# EAGLE schematic untitled (EAGLE 9.6.2)
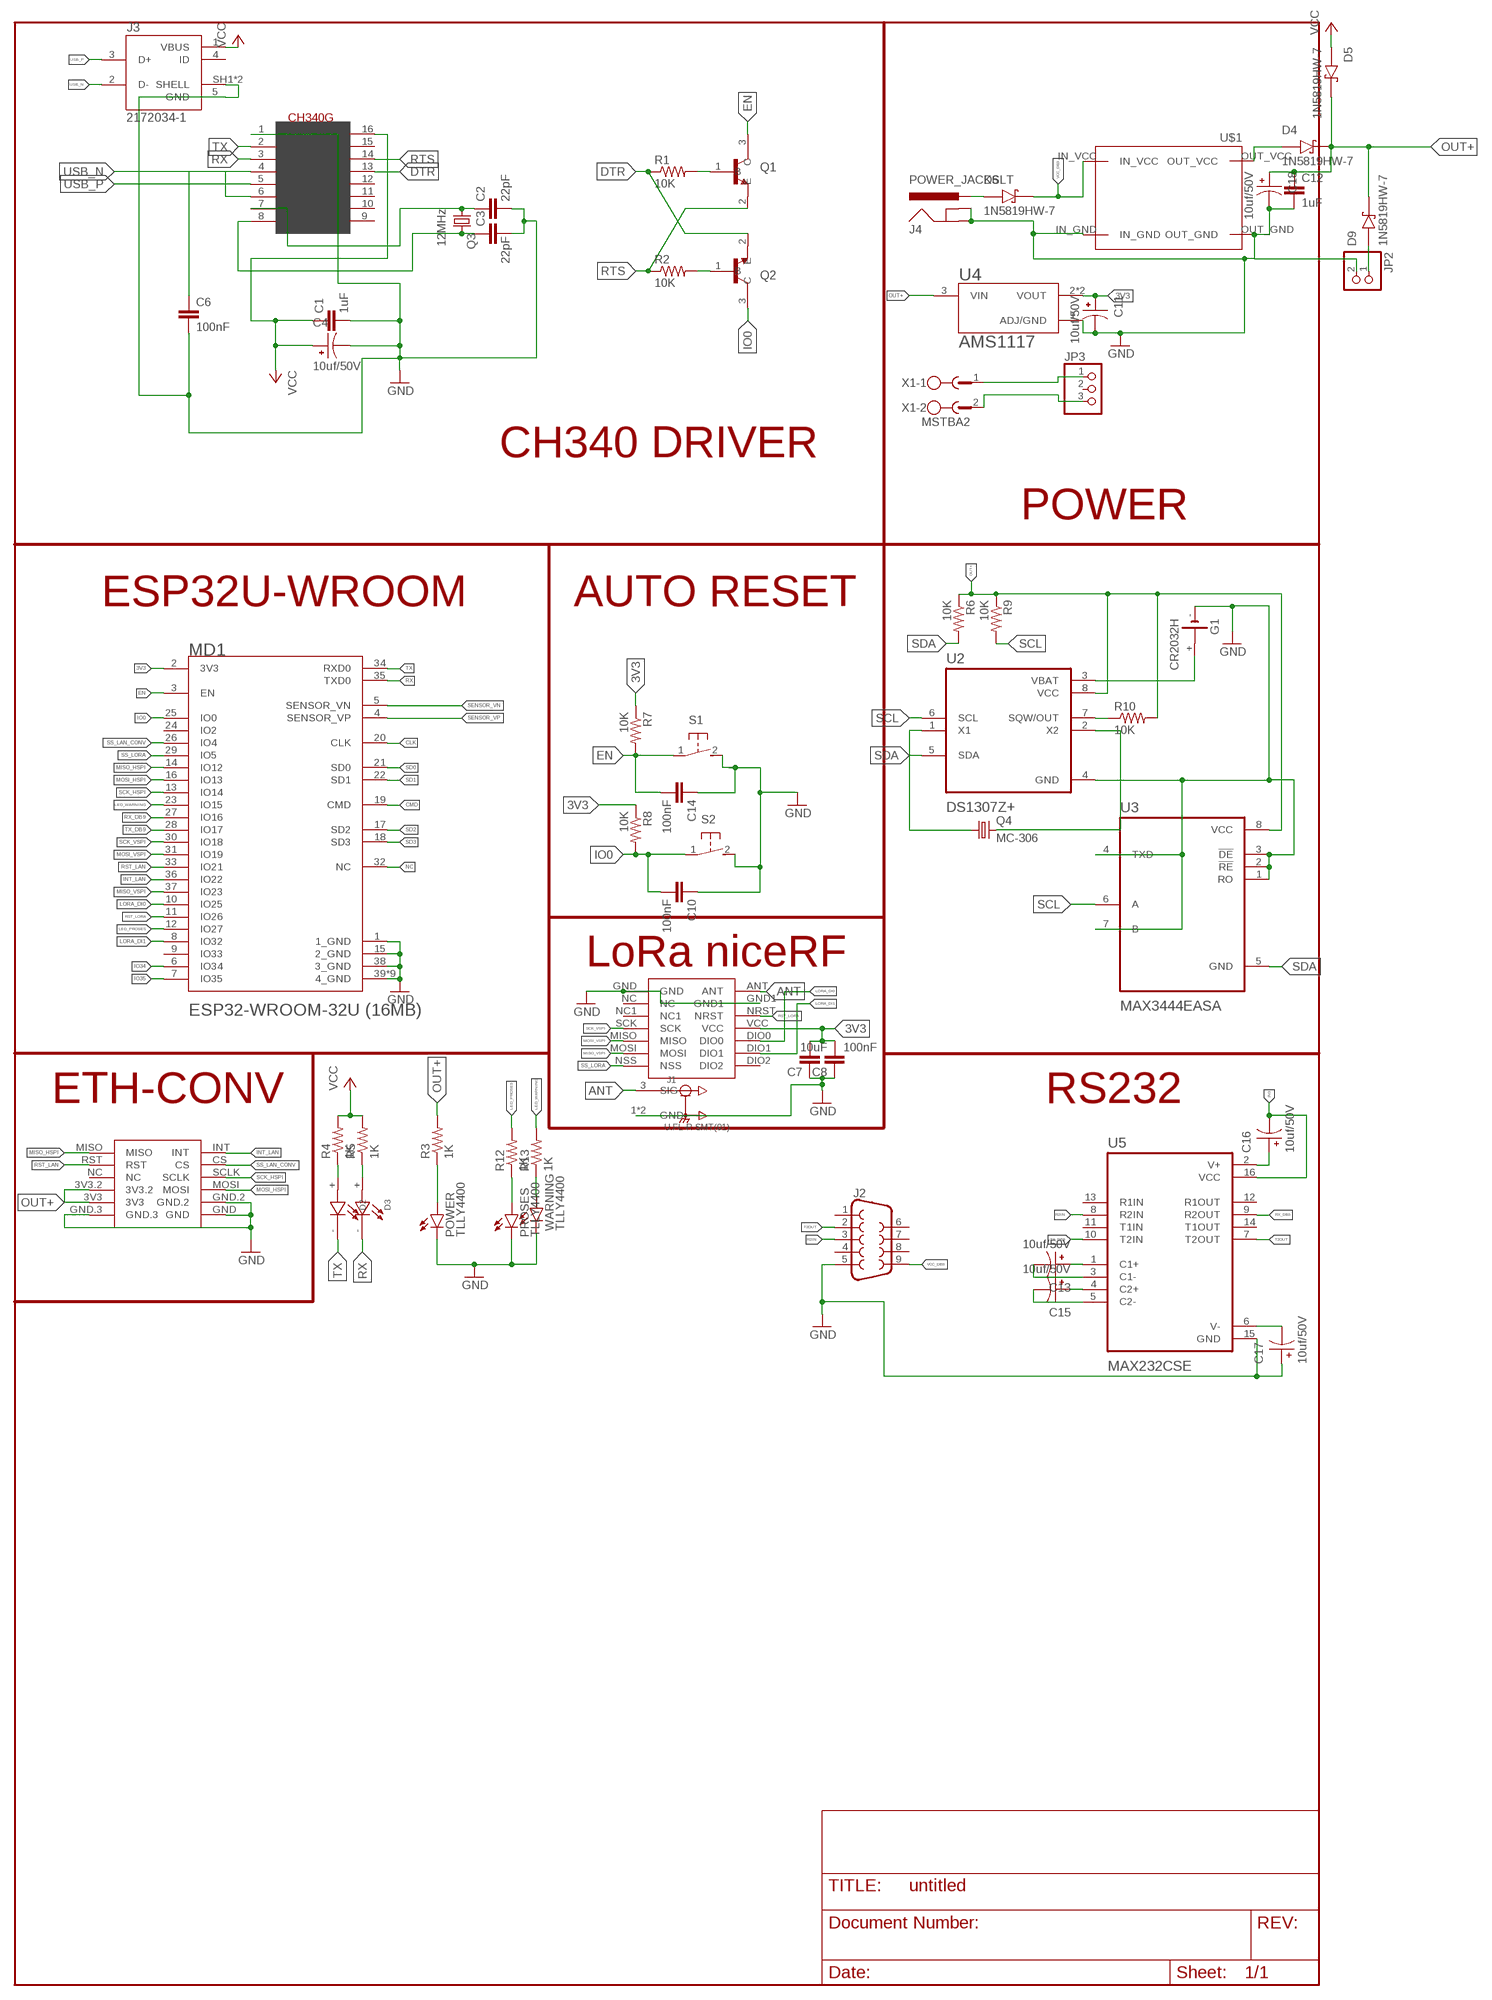
[diagram p0: schematic, sheet 1]

## Parts
C1  1uF  C-EUC0805K  [C0805K]
C2  22pF  C-EUC0805K  [C0805K]
C3  22pF  C-EUC0805K  [C0805K]
C4  10uf/50V  EEEFK1H100V  [CAP_EEEFK1H100V]
C6  100nF  C-EUC0805K  [C0805K]
C7  10uF  C-EUC0805K  [C0805K]
C8  100nF  C-EUC0805K  [C0805K]
C10  100nF  C-EUC0805K  [C0805K]
C11  10uf/50V  EEEFK1H100V  [CAP_EEEFK1H100V]
C12  1uF  C-EUC0805K  [C0805K]
C13  10uf/50V  EEEFK1H100V  [CAP_EEEFK1H100V]
C14  100nF  C-EUC0805K  [C0805K]
C15  10uf/50V  EEEFK1H100V  [CAP_EEEFK1H100V]
C16  10uf/50V  EEEFK1H100V  [CAP_EEEFK1H100V]
C17  10uf/50V  EEEFK1H100V  [CAP_EEEFK1H100V]
C18  10uf/50V  EEEFK1H100V  [CAP_EEEFK1H100V]
D2  Tx  LHN974_RED_LED_1206  [LEDC3216X120N]
D3  Rx  LHN974_RED_LED_1206  [LEDC3216X120N]
D4  1N5819HW-7  [SOD3715X145N]
D5  1N5819HW-7  [SOD3715X145N]
D6  1N5819HW-7  [SOD3715X145N]
D9  1N5819HW-7  [SOD3715X145N]
G1  CR2032H  [CR2032H]
J1  U.FL-R-SMT(01)  [HRS_U.FL-R-SMT(01)]
J2  DB9FEMALE  [DB9]
J3  2172034-1  [TE_2172034-1]
J4  POWER_JACKSLT  [POWER_JACK_SLOT]
JP2  PINHD-1X2  [1X02]
JP3  PINHD-1X3  [1X03]
LORA-NICERF-V1  LORA-NICERF-V2  [LORA-NICERF-V2]
MD1  ESPRESSIF_SYSTEMS_ESP32-WROOM-32U_16MBESPRESSIF_SYSTEMS_ESP32-WROOM-32U_16MB_0_0  [ESPRESSIF_SYSTEMS_ESP32-WROOM-32U_16MB_0]
POWER  TLLY4400  [LED3MM]
PROSES  TLLY4400  [LED3MM]
Q1  MMBT3904  [SOT95P240X120-3N]
Q2  MMBT3904  [SOT95P240X120-3N]
Q3  12MHz  CRYSTALSM49  [SM49]
Q4  MC-306  [MC-306]
R1  10K  R-US_M0805  [M0805]
R2  10K  R-US_M0805  [M0805]
R3  1K  R-US_M0805  [M0805]
R4  1K  R-US_M0805  [M0805]
R5  1K  R-US_M0805  [M0805]
R6  10K  R-US_M0805  [M0805]
R7  10K  R-US_M0805  [M0805]
R8  10K  R-US_M0805  [M0805]
R9  10K  R-US_M0805  [M0805]
R10  10K  R-US_M0805  [M0805]
R12  1K  R-US_M0805  [M0805]
R13  1K  R-US_M0805  [M0805]
S1  31-XX  [B3F-31XX]
S2  31-XX  [B3F-31XX]
U2  DS1307Z+  [SOIC127P600X175-8N]
U3  MAX3444EASA  [SOIC127P600X175-8N]
U4  AMS1117  [SOT229P700X180-4N]
U5  MAX232CSE  [SOIC127P600X175-16N]
U$1  STEPDOWN_SY8205  [STEPDOWN_SY8205]
U$2  CH340G  [SOIC16]
U$3  MINI_W5500  [MINI_W5500]
WARNING  TLLY4400  [LED3MM]
X1  MSTBA2  [MSTBA2]

## Nets
3V3: C7.2 C8.2 C11.1 C16.2 LORA-NICERF-V1.VCC MD1.2(3V3) R7.1 R8.1 U4.2(VOUT) U4.4(VOUT) U5.16(VCC)
ANT: J1.3(SIG) LORA-NICERF-V1.ANT
CLK: MD1.20(CLK)
CMD: MD1.19(CMD)
DTR: Q2.2(E) R1.1 U$2.13(DTR)
EN: C14.2 MD1.3(EN) Q1.3(C) R7.2 S1.1(P)
GND: C1.2 C2.2 C3.2 C4.2 C6.2 C7.1 C8.1 C10.1 C11.2 C12.2 C14.1 C17.1 C18.2 G1.- J1.1(GND) J1.2(GND) J2.5 J3.5(GND) J3.SH1(SHELL) J3.SH2(SHELL) J4.GND@1(GNDBREAK) J4.GND@2(GND) JP2.2 LORA-NICERF-V1.GND LORA-NICERF-V1.GND1 MD1.1(1_GND) MD1.15(2_GND) MD1.38(3_GND) MD1.39(4_GND) MD1.39-2(4_GND) MD1.39-3(4_GND) MD1.39-4(4_GND) MD1.39-5(4_GND) MD1.39-6(4_GND) MD1.39-7(4_GND) MD1.39-8(4_GND) MD1.39-9(4_GND) POWER.K(C) PROSES.K(C) S1.2(S) S2.2(S) U2.4(GND) U3.1(RO) U3.2(!RE) U3.3(!DE) U3.4(TXD) U3.7(B) U4.1(ADJ/GND) U5.15(GND) U$1.IN_GND U$1.OUT_GND U$2.1(GND) U$3.GND U$3.GND.2 U$3.GND.3 WARNING.K(C)
INT_LAN: MD1.36(IO22) U$3.INT
IO0: C10.2 MD1.25(IO0) Q2.3(C) R8.2 S2.1(P)
IO34: MD1.6(IO34)
IO35: MD1.7(IO35)
LED_PROSES: MD1.12(IO27) R12.2
LED_WARNING: MD1.23(IO15) R13.2
LORA_DI0: LORA-NICERF-V1.DIO0 MD1.10(IO25)
LORA_DI1: LORA-NICERF-V1.DIO1 MD1.8(IO32)
MISO_HSPI: MD1.14(IO12) U$3.MISO
MISO_VSPI: LORA-NICERF-V1.MOSI MD1.37(IO23)
MOSI_HSPI: MD1.16(IO13) U$3.MOSI
MOSI_VSPI: LORA-NICERF-V1.MISO MD1.31(IO19)
N$1: C2.1 Q3.1 U$2.7(XI)
N$2: C3.1 Q3.2 U$2.8(XO)
N$3: POWER.A R3.1
N$4: Q1.1(B) R1.2
N$5: Q2.1(B) R2.2
N$6: Q4.1 U2.1(X1)
N$7: Q4.4 U2.2(X2)
N$8: D2.+ R4.1
N$9: D3.+ R5.1
N$10: C13.1 U5.1(C1+)
N$11: D4.A U$1.OUT_VCC
N$12: C6.1 U$2.4(V3)
N$13: JP3.1 X1.1
N$14: C13.2 U5.3(C1-)
N$15: G1.+ U2.3(VBAT)
N$16: JP3.3 X1.2
N$17: D9.A JP2.1
N$18: R10.1 U2.7(SQW/OUT)
N$19: C15.1 U5.4(C2+)
N$23: D6.A J4.PWR
N$24: C15.2 U5.5(C2-)
N$25: PROSES.A R12.1
N$26: C16.1 U5.2(V+)
N$27: C17.2 U5.6(V-)
N$28: R13.1 WARNING.A
NC: MD1.32(NC)
OUT+: C12.1 C18.1 D4.C(K) D5.C(K) D9.C(K) R3.2 R6.1 R9.1 R10.2 U2.8(VCC) U3.8(VCC) U4.3(VIN) U$3.3V3 U$3.3V3.2
R2IN: J2.3 U5.8(R2IN)
RST_LAN: MD1.33(IO21) U$3.RST
RST_LORA: LORA-NICERF-V1.NRST MD1.11(IO26)
RTS: Q1.2(E) R2.1 U$2.14(RTS)
RX: D3.- MD1.35(TXD0) U$2.3(RX)
RX_DB9: MD1.27(IO16) U5.9(R2OUT)
SCK_HSPI: MD1.13(IO14) U$3.SCLK
SCK_VSPI: LORA-NICERF-V1.SCK MD1.30(IO18)
SCL: R9.2 U2.6(SCL) U3.6(A)
SD0: MD1.21(SD0)
SD1: MD1.22(SD1)
SD2: MD1.17(SD2)
SD3: MD1.18(SD3)
SDA: R6.2 U2.5(SDA) U3.5(GND)
SENSOR_VN: MD1.5(SENSOR_VN)
SENSOR_VP: MD1.4(SENSOR_VP)
SS_LAN_CONV: MD1.26(IO4) U$3.CS
SS_LORA: LORA-NICERF-V1.NSS MD1.29(IO5)
T2OUT: J2.2 U5.7(T2OUT)
TX: D2.- MD1.34(RXD0) U$2.2(TX)
TX_DB9: MD1.28(IO17) U5.10(T2IN)
USB_N: J3.2(D-) U$2.6(D-)
USB_P: J3.3(D+) U$2.5(D+)
VCC: C1.1 C4.1 D5.A J3.1(VBUS) R4.2 R5.2 U$2.16(VCC)
VCC_DB9: D6.C(K) J2.9 U$1.IN_VCC
Unconnected: J2.1 J2.4 J2.6 J2.7 J2.8 J3.4(ID) JP3.2 LORA-NICERF-V1.DIO2 LORA-NICERF-V1.NC LORA-NICERF-V1.NC1 MD1.9(IO33) MD1.24(IO2) U5.11(T1IN) U5.12(R1OUT) U5.13(R1IN) U5.14(T1OUT) U$2.9(CTS) U$2.10(DSR) U$2.11(RI) U$2.12(DCD) U$2.15(RS232) U$3.NC

## Notes on the sheet
- CH340 DRIVER
- POWER
- ESP32U-WROOM | AUTO RESET
- LoRa niceRF
- ETH-CONV | RS232

## Library data of the parts
C1-C3 C6-C8 C10 C12 C14 = rcl:C-EU: CAPACITOR, European symbol; SPICEPREFIX: C
C4 C11 C13 C15-C18 = EEEFK1H100V:EEEFK1H100V: Check availability <https://pricing.snapeda.com/parts/EEEFK1H100V/Panasonic/view-part?ref=eda>; AVAILABILITY: In Stock; DESCRIPTION: CAP ALUM 10UF 20% 50V SMD; MF: Panasonic; MP: EEEFK1H100V; PACKAGE: RADIAL-2 Panasonic; PRICE: None; PURCHASE-URL: https://pricing.snapeda.com/search/part/EEEFK1H100V/?ref=eda
D2 D3 = LHN974_RED_LED_1206:LHN974_RED_LED_1206: LED Chip 1206 Check availability <https://pricing.snapeda.com/parts/LHN974%20RED%20LED%201206/Osram/view-part?ref=eda>; AVAILABILITY: Not in stock; DESCRIPTION: 2.6 V Red LED SMD; MF: Osram; MP: LHN974 RED LED 1206; PACKAGE: None; PRICE: None
D4-D6 D9 = 1N5819HW-7:1N5819HW-7: 1N5819HW Series 40 V 1 A Surface Mount Schottky Barrier Rectifier - SOD-123 Check availability <https://pricing.snapeda.com/parts/1N5819HW-7/Diodes%20Inc./view-part?ref=eda>; AVAILABILITY: In Stock; DESCRIPTION: Diode Schottky 40 V 1A Surface Mount SOD-123; MF: Diodes Inc.; MP: 1N5819HW-7; PACKAGE: SOD-123 Fairchild Semiconductor; PRICE: None; PURCHASE-URL: https://pricing.snapeda.com/search/part/1N5819HW-7/?ref=eda
G1 = battery_cr2032:CR2032H: LI BATTERY Varta
J1 = U.FL-R-SMT_01_:U.FL-R-SMT(01): U.FL Series 6 Ghz 50 Ohm Ultra-small SMT Coaxial Cable Receptacle Check availability <https://pricing.snapeda.com/parts/U.FL-R-SMT%2801%29/Hirose/view-part?ref=eda>; AVAILABILITY: In Stock; DESCRIPTION: U.FL (UMCC) Connector Receptacle, Male Pin 50Ohm Surface Mount Solder. RF Connectors / Coaxial Connectors; MF: Hirose; MP: U.FL-R-SMT(01); PACKAGE: None; PRICE: None; PURCHASE-URL: https://pricing.snapeda.com/search/part/U.FL-R-SMT(01)/?ref=eda
J2 = SparkFun-Connectors:DB9: DB9 Connector Standard DB9 (D-Sub 9) serial connector. Can be used for CAN bus as well as RS485 and RS232. Footprint production proven. Here is the female version connector we sell at SparkFun: 9 Pin Female Serial Connector - PCB Mount <https://www.sparkfun.com/products/429> (PRT-00429) This connector has been used on the following SparkFun products: SparkFun RS232 Shifter - SMD <https://www.sparkfun.com/products/449> (PRT-00449) SparkFun RS232 Shifter SMD (No DB9) <https://www.sparkfun.com/products/8780> (PRT-08780); PROD_ID: CONN-08194
J3 = 2172034-1:2172034-1: CONN RCPT USB MINI B 2.0 PCB R/A Check availability <https://pricing.snapeda.com/parts/2172034-1/TE%20Connectivity/view-part?ref=eda>; AVAILABILITY: In Stock; COMMENT: 2172034-1; DESCRIPTION: Conn Mini USB Type B RCP 5 POS 0.8mm Solder RA Thru-Hole 5 Terminal 1 Port Box/Tray; EU_ROHS_COMPLIANCE: Compliant; MF: TE Connectivity; MP: 2172034-1; PACKAGE: None; PRICE: None; PURCHASE-URL: https://pricing.snapeda.com/search/part/2172034-1/?ref=eda
J4 = SparkFun-Connectors:POWER_JACK: Power Jack Connector This is the standard 5.5mm barrel jack for power. The PTH is the most common, proven, reliable, footprint. The Slot footprint only works if the mill layer is transmitted to the PCB fab house so be warned. Here are the connectors we sell at SparkFun: DC Barrel Power Jack/Connector <https://www.sparkfun.com/products/119> (PRT-00119) DC Barrel Power Jack/Connector (SMD) <https://www.sparkfun.com/products/12748> (PRT-12748) DC Barrel Jack Adapter - Breadboard Compatible <https://www.sparkfun.com/products/10811> (PRT-10811) It is used on this SparkFun product (and many, many others): SparkFun RedBoard - Programmed with Arduino <https://www.sparkfun.com/products/12757> (DEV-12757) Also, if you need a mating power supply or connector, please check these out: Wall Adapter Power Supply - 9VDC 650mA <https://www.sparkfun.com/products/298> (TOL-00298) DC Barrel Jack Adapter - Male <https://www.sparkfun.com/products/10287> (PRT-10287); PROD_ID: PRT-00119
JP2 = pinhead:PINHD-1X2: PIN HEADER
JP3 = pinhead:PINHD-1X3: PIN HEADER
LORA-NICERF-V1 = LORA-NICERF-V2:LORA-NICERF-V2
MD1 = Espressif Systems - ESP32-WROOM-32U (16MB):ESPRESSIF_SYSTEMS_ESP32-WROOM-32U_16MB: Bluetooth, WiFi 802.11b/g/n, Bluetooth v4.2 +EDR, Class 1, 2 and 3 Transceiver Module 2.4GHz ~ 2.5GHz Antenna Not Included, U.FL Surface Mount; AUTOMOTIVE: No; BANDWIDTH: 72MHz; CENTROID_NOT_SPECIFIED: No; DATASHEET: https://www.espressif.com/sites/default/files/documentation/esp32-wroom-32d_esp32-wroom-32u_datasheet_en.pdf; DATA_RATE: 150Mbits/s; DEVICE_CLASS_L1: Integrated Circuits (ICs); DEVICE_CLASS_L2: RF Semiconductors and Devices; DEVICE_CLASS_L3: Transceivers; DIGIKEY_DESCRIPTION: RX TXRX MODULE WIFI U.FL SMD; DIGIKEY_PART_NUMBER: 1904-1028-1-ND; FOOTPRINT_VARIANT_NAME_0: Recommended_Land_Pattern; HEIGHT: 3.35mm; INTERFACE: I2C,SPI,UART,Ethernet,I2S,Other; LEAD_FREE: Yes; MAX_FREQUENCY: 2484MHz; MAX_SUPPLY_VOLTAGE: 3.6V; MF: Espressif Systems; MFG_PACKAGE_IDENT: 0; MFG_PACKAGE_IDENT_DATE: 0; MFG_PACKAGE_IDENT_REV: 0; MIN_SUPPLY_VOLTAGE: 3V; MOUSER_PART_NUMBER: 356-ES32WROOM32U16MB; MPN: ESP32-WROOM-32U (16MB); NOMINAL_SUPPLY_CURRENT: 0.5A; NUMBER_OF_ADC_CHANNELS: 16; NUMBER_OF_GPIO: 26; PACKAGE: BT_MODULE; PREFIX: MD; ROHS: Yes; SENSITIVITY: -98dBm; TEMPERATURE_RANGE_HIGH: +85°C; TEMPERATURE_RANGE_LOW: -40°C; VERIFICATION_VERSION: 0.0.0.3
POWER PROSES WARNING = led:TLLY4400: Low Current (2mA) LED 3 mm Tinted Diffused Package color YELLOW Source: Data sheet <http://www.farnell.com/datasheets/391098.pdf>; MF: VISHAY SEMICONDUCTOR; OC_FARNELL: 1612439
Q1 Q2 = MMBT3904:MMBT3904: MMBT3904 Series 40 V CE Breakdown 0.2 A NPN General Purpose Amplifier - SOT-23 Check availability <https://pricing.snapeda.com/parts/MMBT3904/STMicroelectronics/view-part?ref=eda>; AVAILABILITY: Not in stock; DESCRIPTION: SMD Transistor MMBT3904 SOT-23 SMD DIOTEC; MF: STMicroelectronics; MP: MMBT3904; PACKAGE: SOT-23 ON; PRICE: None
Q3 = adafruit:CRYSTAL: CRYSTAL; OC_FARNELL: unknown; OC_NEWARK: unknown
Q4 = crystal:MC-306: kHz RANGE CRYSTAL UNIT SMD Source: MC-306_405_406_E07X.PDF Homepage <http://www.epsontoyocom.co.jp>; MPN: MC-306 60.0KHZ 100PPM ,12.5PF; OC_FARNELL: 1278040; OC_NEWARK: 31M5576
R1-R10 R12 R13 = adafruit:R-US_: RESISTOR, American symbol
S1 S2 = switch-omron:31-XX: OMRON SWITCH; MPN: B3F-3100; OC_FARNELL: 959704; OC_NEWARK: 36M3582
U2 = DS1307Z_:DS1307Z+: Check availability <https://pricing.snapeda.com/parts/DS1307Z/Maxim%20Integrated/view-part?ref=eda>; AVAILABILITY: In Stock; DESCRIPTION: Real Time Clock (RTC) IC Clock/Calendar 56B I²C, 2-Wire Serial 8-SOIC (0.154, 3.90mm Width); MF: Maxim Integrated; MP: DS1307Z; PACKAGE: SOIC-8 Maxim; PRICE: None; PURCHASE-URL: https://pricing.snapeda.com/search/part/DS1307Z/?ref=eda
U3 = MAX3444EASA:MAX3444EASA: Check availability <https://pricing.snapeda.com/parts/MAX3444EASA%2B/Maxim%20Integrated/view-part?ref=eda>; AVAILABILITY: In Stock; DESCRIPTION: Interface IC - transceivers Maxim Integrated MAX3444EASA+ J1708 1/1 SOIC 8 N; MF: Maxim Integrated; MP: MAX3444EASA+; PACKAGE: SOIC-8 Maxim; PRICE: None; PURCHASE-URL: https://pricing.snapeda.com/search/part/MAX3444EASA+/?ref=eda
U4 = AMS1117:AMS1117: Sot223/Pkg 1-Amp 5-Volt Low Drop Out Voltage Regulatator Check availability <https://pricing.snapeda.com/parts/AMS1117/Advanced%20Monolithic%20Systems/view-part?ref=eda>; AVAILABILITY: Not in stock; DESCRIPTION: 1A LOW DROPOUT VOLTAGE REGULATOR SOT-223; MF: Advanced Monolithic Systems; MP: AMS1117; PACKAGE: SOT-223 Seeed Technology; PRICE: None
U5 = MAX232CSE:MAX232CSE: Check availability <https://pricing.snapeda.com/parts/MAX232CSE/Maxim%20Integrated/view-part?ref=eda>; AVAILABILITY: In Stock; DESCRIPTION: 2/2 Transceiver Full RS232 16-SOIC; MF: Maxim Integrated; MP: MAX232CSE; PACKAGE: SOIC-16 Maxim Integrated; PRICE: None; PURCHASE-URL: https://pricing.snapeda.com/search/part/MAX232CSE/?ref=eda
U$1 = STEPDOWN_SY8205:STEPDOWN_SY8205
U$2 = usb-serial:CH340G
U$3 = ethernet-mikroavr:MINI_W5500: MINI ETHERNET W5500, CREATE BY MIKROAVR.COM
X1 = con-phoenix-508:MSTBA2: PHOENIX; MF: FARNELL; MPN: 1757242; OC_FARNELL: 3705171; OC_NEWARK: 71C4161

## Net classes
0 default: clearance 0.2 mm